# EasyEDA schematic SCH_gas-monitor.json
TITLE: Gas Monitor; REV: 1.0; Date: 2024-11-15; Sheet: 1/1; Drawn By: danny-andersen; Company: Danny Andersen
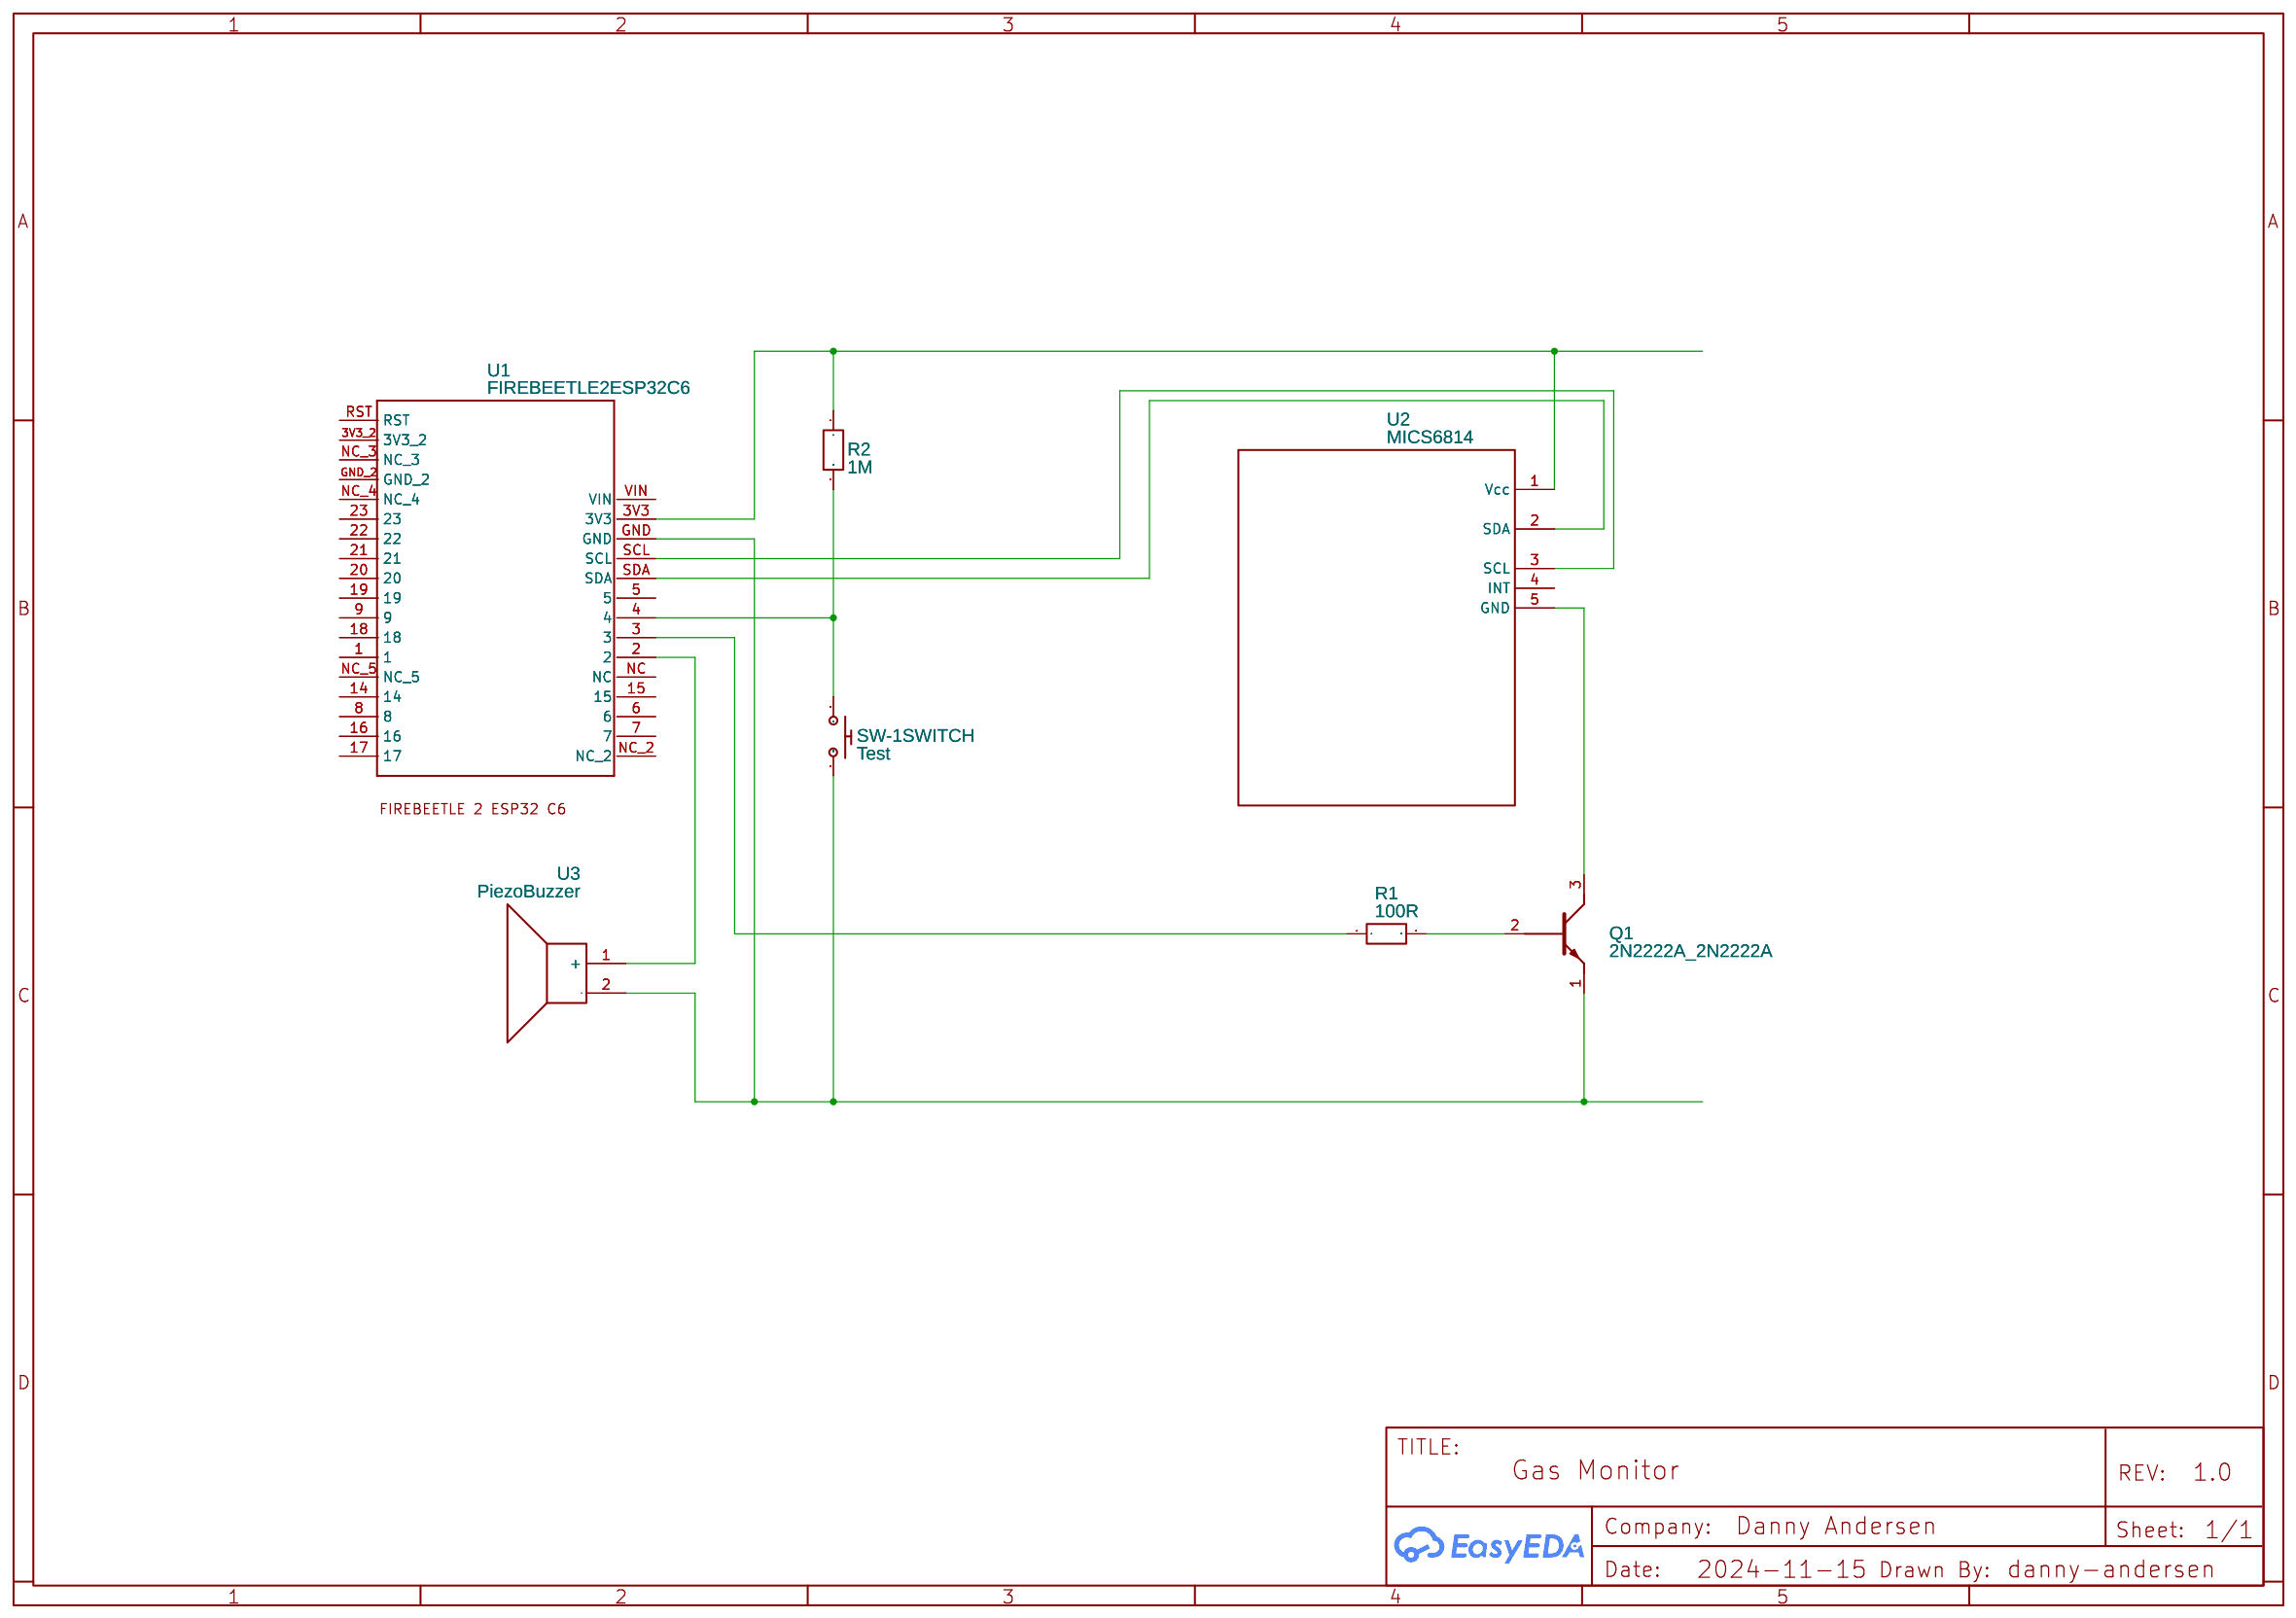
[diagram p0: schematic sheet]

## Parts
Q1  2N2222A_2N2222A  [2N2222A]
R1  100R  [R0603]
R2  1M  [R0603]
SW-1SWITCH  Test  [SMD-BUTTON]
U1  FIREBEETLE2ESP32C6  [LAYER_FIREBEETLE2ESP32C6]
U2  MICS6814  [MICS6814]
U3  PiezoBuzzer  [PIEZOBUZZER]

## Library data of the parts
Q1 = 2N2222A_2N2222A: Contributor: martijnschroder
R1 R2 = R_0603_EU: Contributor: LCEDA_Lib
SW-1SWITCH = Push Button: sourceId: M82WewO60; Supplier Part: COM-08720; Supplier: SparkFun
U1 = FIREBEETLE2ESP32C6: Contributor: elfen
U2 = mics6814: Contributor: shiva_palguna
U3 = PiezoBuzzer: Contributor: claudiupanazan; sourceId: mCAavtrNL

## Nets
Net-(Q1-1): Q1.1 SW-1SWITCH.2(P$2) U1.GND U3.2(-)
Net-(Q1-2): Q1.2 R1.2
Net-(Q1-3): Q1.3 U2.5(GND)
Net-(R1-1): R1.1 U1.3
Net-(R2-1): R2.1 U1.3V3 U2.1(Vcc)
Net-(R2-2): R2.2 SW-1SWITCH.1(P$1) U1.4
Net-(U1-2): U1.2 U3.1(+)
Net-(U1-SCL): U1.SCL U2.3(SCL)
Net-(U1-SDA): U1.SDA U2.2(SDA)

Not connected (* = marked no-connect by the designer): U1 1 3V3_2 5 6 7 8 9 14 15 16 17 18 19 20 21 22 23 GND_2 NC NC_2 NC_3 NC_4 NC_5 RST VIN; U2 4(INT)
